# Altium schematic sheet 07_iMX 8X_LPDDR4.SchDoc
size A3; SheetNumber: 8; SheetTotal: 22
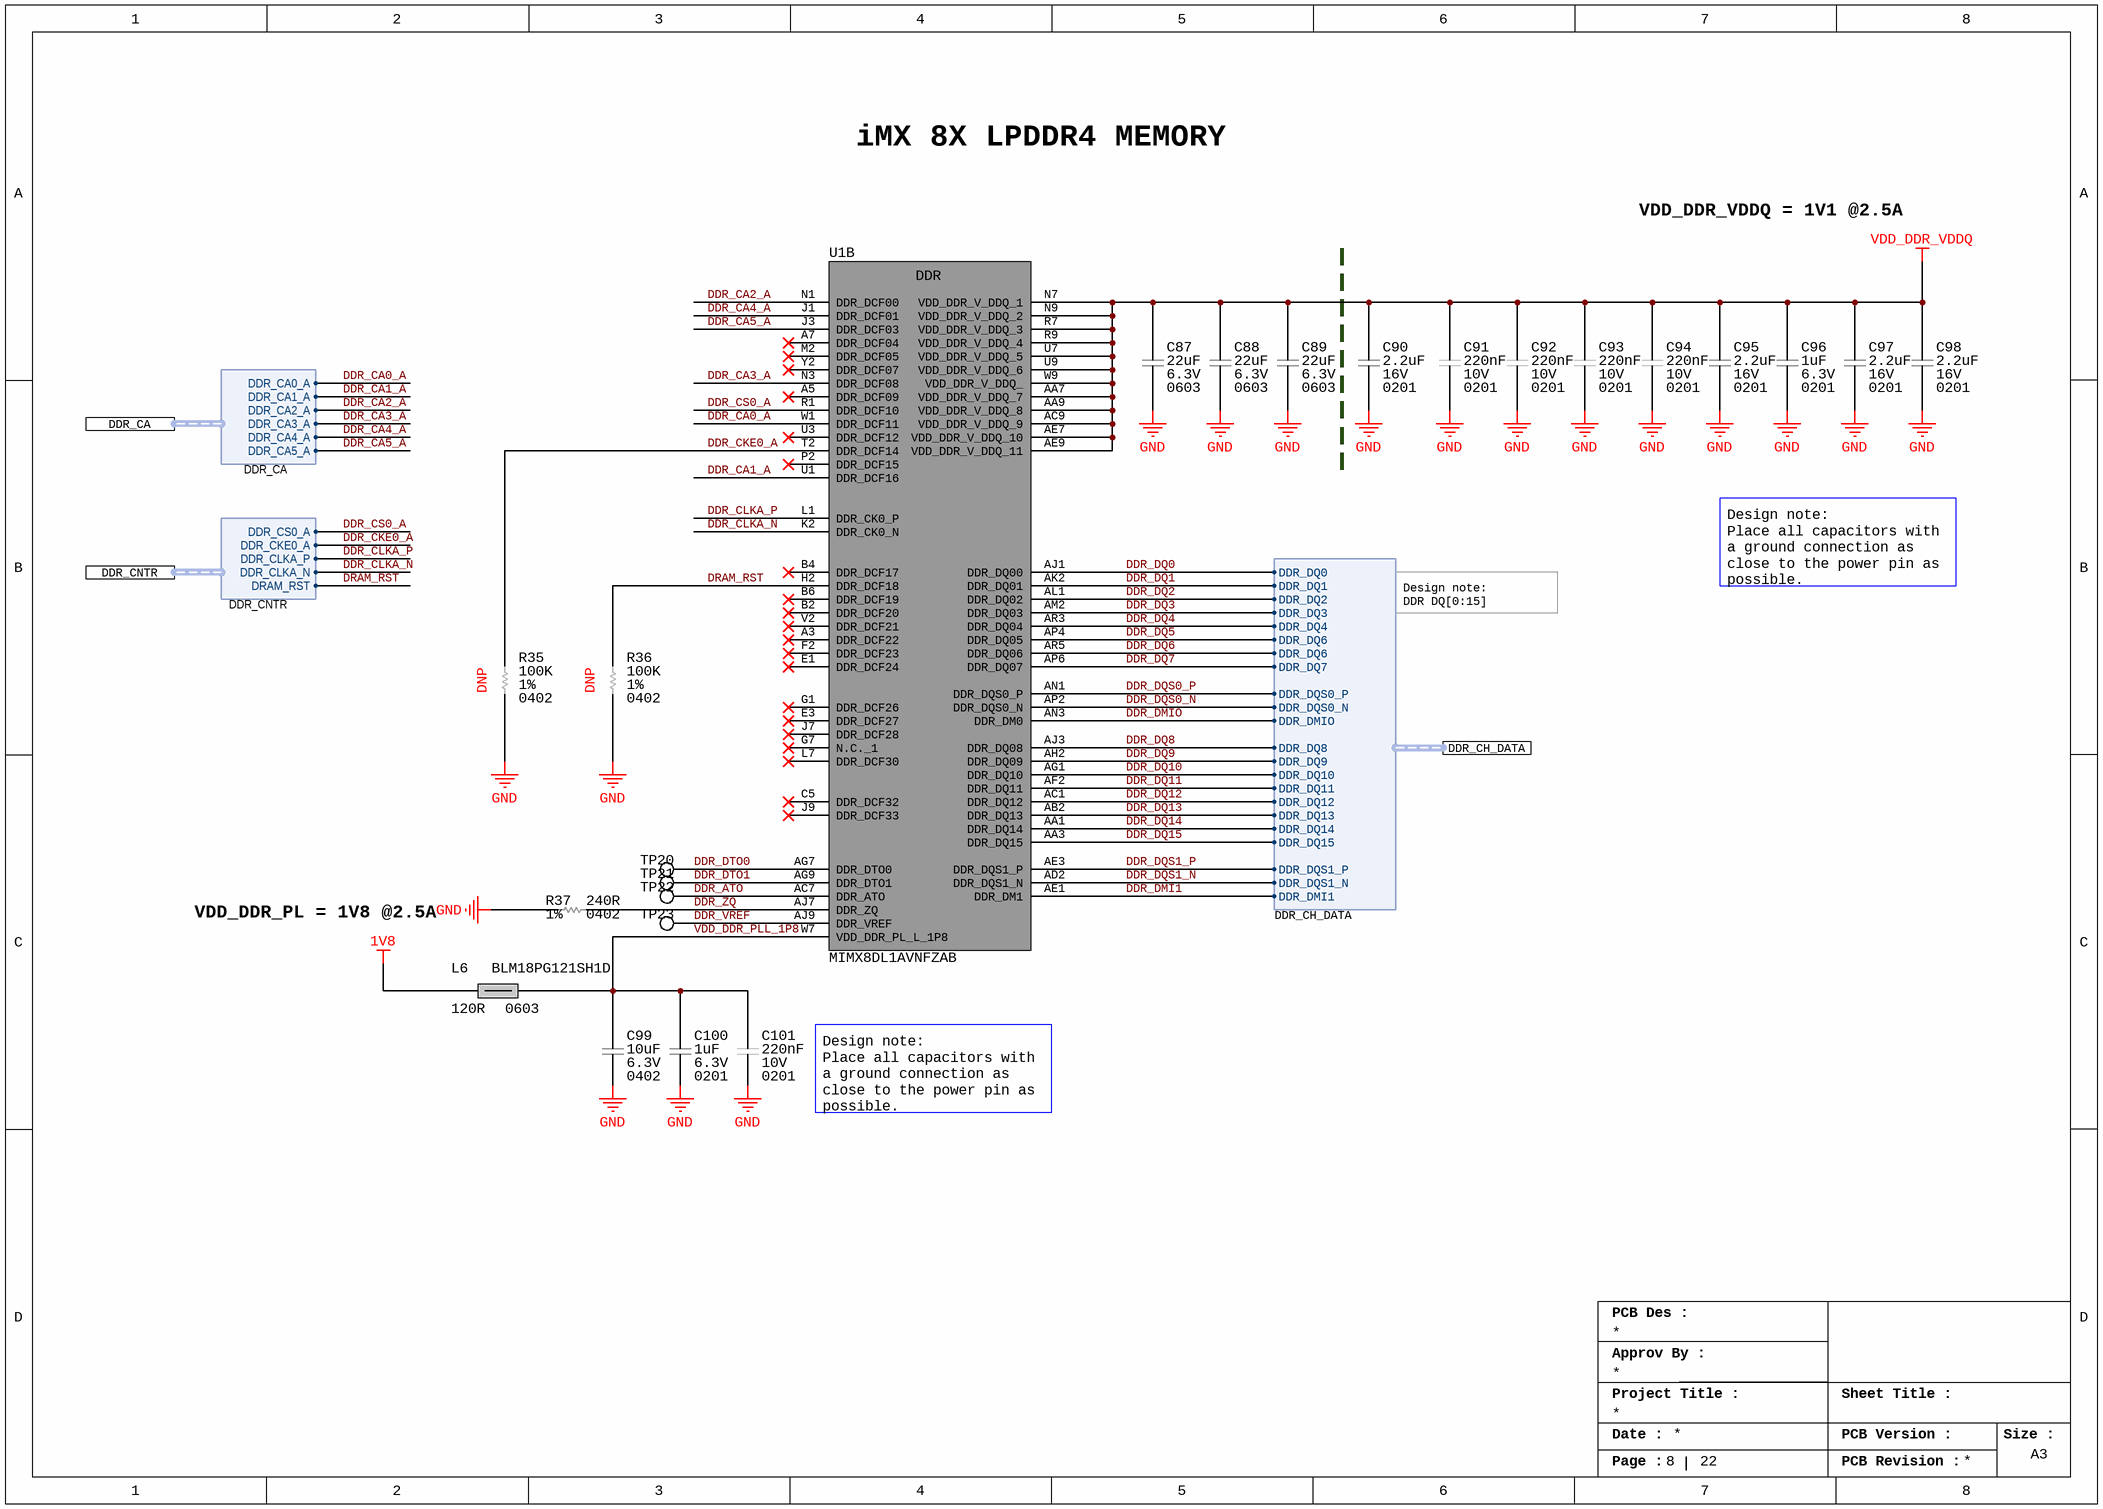
[diagram p0: 07_iMX 8X_LPDDR4.SchDoc]

## Parts
C87  Voltage Rating: 6.3V  Capacitance: 22uF  Case/Package: 0603  [CAP_0603_CAPC1608X08N]  (hidden comment: GRM188R60J226MEA0D)
C88  Voltage Rating: 6.3V  Capacitance: 22uF  Case/Package: 0603  [CAP_0603_CAPC1608X08N]  (hidden comment: GRM188R60J226MEA0D)
C89  Voltage Rating: 6.3V  Capacitance: 22uF  Case/Package: 0603  [CAP_0603_CAPC1608X08N]  (hidden comment: GRM188R60J226MEA0D)
C90  Capacitance: 2.2uF  Voltage Rating: 16V  Case/Package: 0201  [CAP_0201_CAPC0603X03N]  (hidden comment: GRM035R61C225ME01D)
C91  Voltage Rating (DC): 10V  Capacitance: 220nF  Case/Package: 0201  [CAP_0201_CAPC0603X03N]  (hidden comment: LMK063BJ224MP-F)
C92  Voltage Rating (DC): 10V  Capacitance: 220nF  Case/Package: 0201  [CAP_0201_CAPC0603X03N]  (hidden comment: LMK063BJ224MP-F)
C93  Voltage Rating (DC): 10V  Capacitance: 220nF  Case/Package: 0201  [CAP_0201_CAPC0603X03N]  (hidden comment: LMK063BJ224MP-F)
C94  Voltage Rating (DC): 10V  Capacitance: 220nF  Case/Package: 0201  [CAP_0201_CAPC0603X03N]  (hidden comment: LMK063BJ224MP-F)
C95  Capacitance: 2.2uF  Voltage Rating: 16V  Case/Package: 0201  [CAP_0201_CAPC0603X03N]  (hidden comment: GRM035R61C225ME01D)
C96  Voltage Rating (DC): 6.3V  Capacitance: 1uF  Case/Package: 0201  [CAP_0201_CAPC0603X03N]  (hidden comment: 02016D105MAT2A)
C97  Capacitance: 2.2uF  Voltage Rating: 16V  Case/Package: 0201  [CAP_0201_CAPC0603X03N]  (hidden comment: GRM035R61C225ME01D)
C98  Capacitance: 2.2uF  Voltage Rating: 16V  Case/Package: 0201  [CAP_0201_CAPC0603X03N]  (hidden comment: GRM035R61C225ME01D)
C99  Case/Package: 0402  Capacitance: 10uF  Voltage Rating: 6.3V  [CAP_0402_CAPC1005X05N]  (hidden comment: CL05A106MQ5NUNC)
C100  Voltage Rating (DC): 6.3V  Capacitance: 1uF  Case/Package: 0201  [CAP_0201_CAPC0603X03N]  (hidden comment: 02016D105MAT2A)
C101  Voltage Rating (DC): 10V  Capacitance: 220nF  Case/Package: 0201  [CAP_0201_CAPC0603X03N]  (hidden comment: LMK063BJ224MP-F)
L6  BLM18PG121SH1D  Impedance: 120R  Case/Package: 0603  [IND_0603_INDC1608X08N]
R35  Resistance: 100K  Tolerance: 1%  Case/Package: 0402  [RES_0402_RESC1005X04N]  (hidden comment: RC0402FR-07100KL)
R36  Resistance: 100K  Tolerance: 1%  Case/Package: 0402  [RES_0402_RESC1005X04N]  (hidden comment: RC0402FR-07100KL)
R37  Tolerance: 1%  Resistance: 240R  Case/Package: 0402  [RES_0402_RESC1005X04N]  (hidden comment: RC0402FR-07240RL)
TP20  NO COMPONENT  [TP_PAD_0.5MM_SMD_ROUND]  (value not drawn)  (no BOM)
TP21  NO COMPONENT  [TP_PAD_0.5MM_SMD_ROUND]  (value not drawn)  (no BOM)
TP22  NO COMPONENT  [TP_PAD_0.5MM_SMD_ROUND]  (value not drawn)  (no BOM)
TP23  NO COMPONENT  [TP_PAD_0.5MM_SMD_ROUND]  (value not drawn)  (no BOM)
U1  MIMX8DL1AVNFZAB  [MIMX8DL1AVNFZAB]  (part B of 15)

## Ports
DDR_CA (harness DDR_CA), DDR_CH_DATA (harness DDR_CH_DATA), DDR_CNTR (harness DDR_CNTR)

## Harnesses
DDR_CH_DATA: DDR_DQ0, DDR_DQ1, DDR_DQ2, DDR_DQ3, DDR_DQ4, DDR_DQ6, DDR_DQ6, DDR_DQ7, DDR_DQS0_P, DDR_DQS0_N, DDR_DMIO, DDR_DQ8, DDR_DQ9, DDR_DQ10, DDR_DQ11, DDR_DQ12, DDR_DQ13, DDR_DQ14, DDR_DQ15, DDR_DQS1_P, DDR_DQS1_N, DDR_DMI1
DDR_CA: DDR_CA0_A, DDR_CA1_A, DDR_CA2_A, DDR_CA3_A, DDR_CA4_A, DDR_CA5_A
DDR_CNTR: DDR_CS0_A, DDR_CKE0_A, DDR_CLKA_P, DDR_CLKA_N, DRAM_RST

## Nets
1V8: L6.1
GND: C87.1 C88.1 C89.1 C90.1 C91.1 C92.1 C93.1 C94.1 C95.1 C96.1 C97.1 C98.1 C99.1 C100.1 C101.1 R35.1 R36.1 R37.1
VDD_DDR_VDDQ: C87.2 C88.2 C89.2 C90.2 C91.2 C92.2 C93.2 C94.2 C95.2 C96.2 C97.2 C98.2 U1.AA7(VDD_DDR_V_DDQ_7) U1.AA9(VDD_DDR_V_DDQ_8) U1.AC9(VDD_DDR_V_DDQ_9) U1.AE7(VDD_DDR_V_DDQ_10) U1.AE9(VDD_DDR_V_DDQ_11) U1.N7(VDD_DDR_V_DDQ_1) U1.N9(VDD_DDR_V_DDQ_2) U1.R7(VDD_DDR_V_DDQ_3) U1.R9(VDD_DDR_V_DDQ_4) U1.U7(VDD_DDR_V_DDQ_5) U1.U9(VDD_DDR_V_DDQ_6) U1.W9(VDD_DDR_V_DDQ_)
DDR_ATO: TP22.1 U1.AC7(DDR_ATO)
DDR_CA0_A: U1.W1(DDR_DCF11) ; port DDR_CA.DDR_CA0_A
DDR_CA1_A: U1.U1(DDR_DCF16) ; port DDR_CA.DDR_CA1_A
DDR_CA2_A: U1.N1(DDR_DCF00) ; port DDR_CA.DDR_CA2_A
DDR_CA3_A: U1.N3(DDR_DCF08) ; port DDR_CA.DDR_CA3_A
DDR_CA4_A: U1.J1(DDR_DCF01) ; port DDR_CA.DDR_CA4_A
DDR_CA5_A: U1.J3(DDR_DCF03) ; port DDR_CA.DDR_CA5_A
DDR_CKE0_A: R35.2 U1.T2(DDR_DCF14) ; port DDR_CNTR.DDR_CKE0_A
DDR_CLKA_N: U1.K2(DDR_CK0_N) ; port DDR_CNTR.DDR_CLKA_N
DDR_CLKA_P: U1.L1(DDR_CK0_P) ; port DDR_CNTR.DDR_CLKA_P
DDR_CS0_A: U1.R1(DDR_DCF10) ; port DDR_CNTR.DDR_CS0_A
DDR_DMI1: U1.AE1(DDR_DM1) ; port DDR_CH_DATA.DDR_DMI1
DDR_DMIO: U1.AN3(DDR_DM0) ; port DDR_CH_DATA.DDR_DMIO
DDR_DQ0: U1.AJ1(DDR_DQ00) ; port DDR_CH_DATA.DDR_DQ0
DDR_DQ1: U1.AK2(DDR_DQ01) ; port DDR_CH_DATA.DDR_DQ1
DDR_DQ2: U1.AL1(DDR_DQ02) ; port DDR_CH_DATA.DDR_DQ2
DDR_DQ3: U1.AM2(DDR_DQ03) ; port DDR_CH_DATA.DDR_DQ3
DDR_DQ4: U1.AR3(DDR_DQ04) ; port DDR_CH_DATA.DDR_DQ4
DDR_DQ5: U1.AP4(DDR_DQ05) U1.AR5(DDR_DQ06) ; port DDR_CH_DATA.DDR_DQ6  [also labelled DDR_DQ6]
DDR_DQ7: U1.AP6(DDR_DQ07) ; port DDR_CH_DATA.DDR_DQ7
DDR_DQ8: U1.AJ3(DDR_DQ08) ; port DDR_CH_DATA.DDR_DQ8
DDR_DQ9: U1.AH2(DDR_DQ09) ; port DDR_CH_DATA.DDR_DQ9
DDR_DQ10: U1.AG1(DDR_DQ10) ; port DDR_CH_DATA.DDR_DQ10
DDR_DQ11: U1.AF2(DDR_DQ11) ; port DDR_CH_DATA.DDR_DQ11
DDR_DQ12: U1.AC1(DDR_DQ12) ; port DDR_CH_DATA.DDR_DQ12
DDR_DQ13: U1.AB2(DDR_DQ13) ; port DDR_CH_DATA.DDR_DQ13
DDR_DQ14: U1.AA1(DDR_DQ14) ; port DDR_CH_DATA.DDR_DQ14
DDR_DQ15: U1.AA3(DDR_DQ15) ; port DDR_CH_DATA.DDR_DQ15
DDR_DQS0_N: U1.AP2(DDR_DQS0_N) ; port DDR_CH_DATA.DDR_DQS0_N
DDR_DQS0_P: U1.AN1(DDR_DQS0_P) ; port DDR_CH_DATA.DDR_DQS0_P
DDR_DQS1_N: U1.AD2(DDR_DQS1_N) ; port DDR_CH_DATA.DDR_DQS1_N
DDR_DQS1_P: U1.AE3(DDR_DQS1_P) ; port DDR_CH_DATA.DDR_DQS1_P
DDR_DTO0: TP20.1 U1.AG7(DDR_DTO0)
DDR_DTO1: TP21.1 U1.AG9(DDR_DTO1)
DDR_VREF: TP23.1 U1.AJ9(DDR_VREF)
DDR_ZQ: R37.2 U1.AJ7(DDR_ZQ)
DRAM_RST: R36.2 U1.H2(DDR_DCF18) ; port DDR_CNTR.DRAM_RST
VDD_DDR_PLL_1P8: C99.2 C100.2 C101.2 L6.2 U1.W7(VDD_DDR_PL_L_1P8)

Not connected (* = marked no-connect by the designer): U1 A3(DDR_DCF22)* A5(DDR_DCF09)* A7(DDR_DCF04)* B2(DDR_DCF20)* B4(DDR_DCF17)* B6(DDR_DCF19)* C5(DDR_DCF32)* E1(DDR_DCF24)* E3(DDR_DCF27)* F2(DDR_DCF23)* G1(DDR_DCF26)* G7(N.C._1)* J7(DDR_DCF28)* J9(DDR_DCF33)* L7(DDR_DCF30)* M2(DDR_DCF05)* P2(DDR_DCF15)* U3(DDR_DCF12)* V2(DDR_DCF21)* Y2(DDR_DCF07)*

## Notes on the sheet
- iMX 8X LPDDR4 MEMORY
- VDD_DDR_VDDQ = 1V1 @2.5A
- Design note:
  Place all capacitors with a ground connection as close to the power pin as possible.
- Design note:
  DDR DQ[0:15]
- (near R35) DNP
- (near R36) DNP
- VDD_DDR_PL = 1V8 @2.5A
- PCB Des :
- Approv By :
- Project Title :
- Sheet Title :
- Date :
- PCB Version :
- Size :
- A3
- Page :
- PCB Revision :
- (in symbol IC_MPU_ARM_1.2GHz_MIMX8DL1AVNFZAB, part B) DDR

## Library data of the parts
C87-C89 = CAP_22uF_6.3V_X5R_0603: Multilayer Ceramic Capacitor, 22 uF, 6.3 V, ï¿½ 20%, X5R, 0603 [1608 Metric]; Manufacturer: Murata; Supplier 1: Digikey; Manufacturer Part Number: GRM188R60J226MEA0D; RoHS: Yes; Category: Ceramic Capacitors; Stock 1: 4736669; Pricing 1: 1=0.2, 10=0.113, 50=0.0794, 100=0.069, 500=0.05144, 1000=0.04599 (USD); Mount: Surface Mount; Number of Pins: 2; Case Code (Metric): 1608; Case Code (Imperial): 0603; Weight: 0.000222oz; Material: Ceramic; Min Operating Temperature: -55°C; Max Operating Temperature: 85°C; Packaging: Tape and Reel; Package Quantity: 1; Series: GRM; Tolerance: 20%; Dielectric: X5R; Termination: SMD/SMT; Voltage Rating (DC): 6.3V; Length: 0.063inch; Width: 0.031inch; Height: 0.8mm; Thickness: 0.039inch; Lead Free: Lead Free; RoHS Compliant: Yes; Reach SVHC Compliant: No; ComponentLink1URL: https://datasheet.ciiva.com/29540/partnumbering-e-01-29540441.pdf?src-supplier=Digikey; ComponentLink1Description: https://datasheet.ciiva.com/29540/partnumbering-e-01-29540441.pdf?src-supplier=Digikey; ComponentLink2URL: https://datasheet.ciiva.com/29540/partnumbering-e-01-29540442.pdf?src-supplier=Digikey; ComponentLink2Description: https://datasheet.ciiva.com/29540/partnumbering-e-01-29540442.pdf?src-supplier=Digikey; ComponentLink3URL: https://datasheet.ciiva.com/29540/partnumbering-e-01-29540443.pdf?src-supplier=Digikey; ComponentLink3Description: https://datasheet.ciiva.com/29540/partnumbering-e-01-29540443.pdf?src-supplier=Digikey; Supplier Part Number 1: 490-7611-1-ND
C90 C95 C97 C98 = CAP_2.2uF_16V_X5R_0201: General Up to 85C Reflow soldering; Manufacturer: Murata; Material: Ceramic; Dielectric: X5R; Tolerance: 20%; Supplier 1: Digikey; Manufacturer Part Number: GRM035R61C225ME01D; RoHS: No; Category: Ceramic Capacitors; Stock 1: 18674; Pricing 1: 1=0.36, 10=0.233, 50=0.1636, 100=0.1321, 500=0.09814, 1000=0.08587, 2500=0.08178, 5000=0.07565 (USD); Min Operating Temperature: -55°C; Max Operating Temperature: 85°C; Voltage Rating (DC): 16V; Length: 600um; Width: 300um; Height: 550um; Thickness: 500um; RoHS Compliant: Yes; ComponentLink1URL: https://datasheet.octopart.com/GRM035R61C225ME01D-Murata-datasheet-165579666.pdf?src-supplier=TME; ComponentLink1Description: https://datasheet.octopart.com/GRM035R61C225ME01D-Murata-datasheet-165579666.pdf?src-supplier=TME; Supplier Part Number 1: 490-GRM035R61C225ME01DCT-ND
C91-C94 C101 = CAP_0.22UF_10V_X5R_0201: Multilayer Ceramic Capacitors (High dielectric type), 10V, 0.22 uF, ± 20 %, 0201, X5R, RoHS; Manufacturer: Taiyo Yuden; Material: 4241ConductorMaterial; Tolerance: 20%; Supplier 1: Digikey; Manufacturer Part Number: LMK063BJ224MP-F; RoHS: Yes; Category: Ceramic Capacitors; Stock 1: 6053224; Pricing 1: 1=0.12, 10=0.08, 50=0.0478, 100=0.0375, 500=0.02772, 1000=0.02295, 2500=0.02136, 5000=0.01954 (USD); Mount: Surface Mount; Case Code (Metric): 0603; Case Code (Imperial): 0201; Min Operating Temperature: -55°C; Max Operating Temperature: 85°C; Voltage Rating: 10V; Packaging: Tape and Reel; Package Quantity: 15000; Dielectric: X5R; Termination: SMD/SMT; Voltage: 10V; Series: M; Construction: Flat; Length: 0.6mm; Width: 0.3mm; Height: 0.3mm; Depth: 0.3mm; Radiation Hardening: No; Halogen Free: Halogen Free; RoHS Compliant: Yes; Reach SVHC Compliant: Unknown; ComponentLink1URL: https://datasheet.ciiva.com/134/lmk063bj224mp-f-ss-134995.pdf?src-supplier=Digikey; ComponentLink1Description: https://datasheet.ciiva.com/134/lmk063bj224mp-f-ss-134995.pdf?src-supplier=Digikey; ComponentLink2URL: https://datasheet.ciiva.com/11464/lmk063bj224mp-f-ss-11464053.pdf?src-supplier=Avnet; ComponentLink2Description: https://datasheet.ciiva.com/11464/lmk063bj224mp-f-ss-11464053.pdf?src-supplier=Avnet; ComponentLink3URL: https://datasheet.ciiva.com/15921/1589lmk063bj224mp-f-15921250.pdf?src-supplier=Onlinecomponents.com; ComponentLink3Description: https://datasheet.ciiva.com/15921/1589lmk063bj224mp-f-15921250.pdf?src-supplier=Onlinecomponents.com; ComponentLink4URL: https://datasheet.ciiva.com/26872/getdatasheetpartid-639019-26872592.pdf?src-supplier=Verical; ComponentLink4Description: https://datasheet.ciiva.com/26872/getdatasheetpartid-639019-26872592.pdf?src-supplier=Verical; ComponentLink5URL: https://datasheet.ciiva.com/30243/100lmk063bj224mp-f-30243150.pdf?src-supplier=Onlinecomponents.com; ComponentLink5Description: https://datasheet.ciiva.com/30243/100lmk063bj224mp-f-30243150.pdf?src-supplier=Onlinecomponents.com; ComponentLink6URL: https://datasheet.ciiva.com/28645/746258-28645141.pdf?src-supplier=Element14; ComponentLink6Description: https://datasheet.ciiva.com/28645/746258-28645141.pdf?src-supplier=Element14; ComponentLink7URL: https://datasheet.ciiva.com/5422/mlcc-all-e-541559-5422365.pdf?src-supplier=Mouser; ComponentLink7Description: https://datasheet.ciiva.com/5422/mlcc-all-e-541559-5422365.pdf?src-supplier=Mouser; Supplier Part Number 1: 587-2483-1-ND
C96 C100 = CAP_1UF_6.3V_X5R_0201: 0201 1 uF 6.3 V ±20 % Tolerance X5R Surface Mount Multilayer Ceramic Capacitor; Manufacturer: Kyocera AVX; Tolerance: 20%; Supplier 1: Mouser; Manufacturer Part Number: 02016D105MAT2A; RoHS: Yes; Category: Ceramic Capacitors; Stock 1: 1026413; Pricing 1: 1=0.1, 10=0.028, 50=0.028, 100=0.014, 1000=0.008, 10000=0.006 (USD); Mount: Surface Mount; Number of Pins: 2; Case Code (Metric): 0603; Case Code (Imperial): 0201; Min Operating Temperature: -55°C; Max Operating Temperature: 85°C; Packaging: Cut Tape; Series: -; Voltage Rating: 6.3V; Package Quantity: 1; Length: 0.024inch; Width: 0.012inch; Thickness: 0.013inch; Depth: 0.3mm; Lead Free: Lead Free; RoHS Compliant: Yes; Reach SVHC Compliant: No; ComponentLink1URL: https://datasheet.ciiva.com/6265/cx5r-6265595.pdf?src-supplier=Digi-Key; ComponentLink1Description: https://datasheet.ciiva.com/6265/cx5r-6265595.pdf?src-supplier=Digi-Key; ComponentLink2URL: https://datasheet.ciiva.com/1123/1666675-1123122.pdf?src-supplier=Element14; ComponentLink2Description: https://datasheet.ciiva.com/1123/1666675-1123122.pdf?src-supplier=Element14; ComponentLink3URL: https://datasheet.ciiva.com/14891/cx5r-14891029.pdf?src-supplier=Digi-Key; ComponentLink3Description: https://datasheet.ciiva.com/14891/cx5r-14891029.pdf?src-supplier=Digi-Key; ComponentLink4URL: https://datasheet.ciiva.com/7614/cx5r-7614682.pdf?src-supplier=Digi-Key; ComponentLink4Description: https://datasheet.ciiva.com/7614/cx5r-7614682.pdf?src-supplier=Digi-Key; ComponentLink5URL: https://datasheet.ciiva.com/14891/cx5r-14891030.pdf?src-supplier=Digi-Key; ComponentLink5Description: https://datasheet.ciiva.com/14891/cx5r-14891030.pdf?src-supplier=Digi-Key; Supplier Part Number 1: 581-02016D105MAT2A; Dielectric: X5R
C99 = CAP_10UF_6.3V_X5R_0402: Cap Ceramic 10uF 6.3V X5R 20% SMD 0402 85C T/R; Manufacturer: Samsung; Supplier 1: Digikey; Manufacturer Part Number: CL05A106MQ5NUNC; RoHS: Yes; Category: Ceramic Capacitors; Stock 1: 6097180; Pricing 1: 1=0.24, 10=0.153, 50=0.0968, 100=0.0774, 500=0.05588, 1000=0.04943, 2500=0.04728, 5000=0.04299 (USD); Mount: Surface Mount; Case Code (Metric): 1005; Case Code (Imperial): 0402; Min Operating Temperature: -55°C; Max Operating Temperature: 85°C; Packaging: Tape and Reel; Tolerance: 20%; Dielectric: X5R; Series: CL; Package Quantity: 1; Construction: Flat; Length: 1mm; Width: 0.02inch; Height: 0.5mm; Depth: 0.5mm; Thickness: 0.028inch; Radiation Hardening: No; RoHS Compliant: Yes; ComponentLink1URL: https://datasheet.ciiva.com/16437/cl05a106mq5nunc-16437356.pdf?src-supplier=Future+Electronics; ComponentLink1Description: https://datasheet.ciiva.com/16437/cl05a106mq5nunc-16437356.pdf?src-supplier=Future+Electronics; ComponentLink2URL: https://datasheet.ciiva.com/26877/getdatasheetpartid-355289-26877841.pdf?src-supplier=Verical; ComponentLink2Description: https://datasheet.ciiva.com/26877/getdatasheetpartid-355289-26877841.pdf?src-supplier=Verical; Supplier Part Number 1: 1276-1451-1-ND
L6 = IND_FERRITE_BEADS_120R_2A_0603_BLM18PG121SH1D: Ferrite Beads Multi-Layer 120Ohm 25% 100MHz 2A 50mOhm DCR 0603 Automotive Paper T/R; Manufacturer: Murata; Number of Lines: 1; Shielding: Unshielded; DC Resistance-Max: 50mR; Supplier 1: Digi-Key; Manufacturer Part Number: BLM18PG121SH1D; RoHS: Yes; Category: Ferrite Beads and Chips; Stock 1: 282143; Pricing 1: 1=0.11, 10=0.086, 25=0.0772, 50=0.0566, 100=0.0489, 250=0.03864, 500=0.03262, 1000=0.02747 (USD); Mount: Surface Mount; Case Code (Metric): 1608; Case Code (Imperial): 0603; Weight: 7.1E-05oz; Contact Plating: Tin,Matte; Material: Ferrite; Min Operating Temperature: -55°C; Max Operating Temperature: 125°C; Tolerance: 25%; Packaging: Tape and Reel; Package Quantity: 1; Current Rating: 2A; Max Current Rating: 2A; Termination: SMD/SMT; Max DC Current: 2A; Test Frequency: 100MHz; Number of Circuits: 1; Series: EMIFIL®, BLM18P; Length: 1.6mm; Width: 0.031inch; Height: 0.8mm; Depth: 0.8mm; Ratings: AEC-Q200; Lead Free: Lead Free; RoHS Compliant: Yes; ComponentLink1URL: https://datasheet.octopart.com/BLM18PG121SH1D-Murata-datasheet-141273661.pdf?src-supplier=Element14; ComponentLink1Description: https://datasheet.octopart.com/BLM18PG121SH1D-Murata-datasheet-141273661.pdf?src-supplier=Element14; ComponentLink2URL: https://datasheet.octopart.com/BLM18PG121SH1D-Murata-datasheet-62086335.pdf?src-supplier=Future+Electronics; ComponentLink2Description: https://datasheet.octopart.com/BLM18PG121SH1D-Murata-datasheet-62086335.pdf?src-supplier=Future+Electronics; ComponentLink3URL: http://search.murata.co.jp/Ceramy/image/img/PDF/ENG/L0132S0193BLM18P.pdf?src-supplier=Avnet; ComponentLink3Description: http://search.murata.co.jp/Ceramy/image/img/PDF/ENG/L0132S0193BLM18P.pdf?src-supplier=Avnet; ComponentLink4URL: https://www.murata.com/en-us/products/productdata/8796738650142/ENFA0003.pdf?src-supplier=Digi-Key; ComponentLink4Description: https://www.murata.com/en-us/products/productdata/8796738650142/ENFA0003.pdf?src-supplier=Digi-Key; Supplier Part Number 1: 490-7815-6-ND
R35 R36 = RES_100K_1%_100mW_0402: SMD Chip Resistor, 100 kOhm, ± 1%, 63 mW, 0402 [1005 Metric], Thick Film, General Purpose; Manufacturer: Yageo; Temperature Coefficient: 100ppm/°C; Power Rating: 63mW; Voltage Rating: 50V; Supplier 1: Digi-Key; Manufacturer Part Number: RC0402FR-07100KL; RoHS: Yes; Category: Chip SMD Resistors; Stock 1: 27579413; Pricing 1: 1=0.1, 10=0.014, 50=0.0084, 100=0.007, 500=0.00464, 1000=0.00396, 5000=0.00282 (USD); Case Code (Metric): 1005; Case Code (Imperial): 0402; Min Operating Temperature: -55°C; Max Operating Temperature: 155°C; Resistor Type: Thick Film; Packaging: Tape and Reel; Package Quantity: 1; Number of Terminations: 2; Termination: SMD/SMT; Max Power Dissipation: 63mW; Features: Moisture Resistant; Series: RC; Resistance Tolerance: 1%; Construction: Rectangular; Technology: THICK FILM; Voltage Rating (AC): 50V; Length: 0.039inch; Width: 0.02inch; Height: 0.016inch; Depth: 0.5mm; Reach SVHC Compliant: No; RoHS Compliant: Yes; Lead Free: 5697LeadFree; Military Standard: Not; ComponentLink1URL: https://datasheet.ciiva.com/11819/0900766b80c66297-11819452.pdf?src-supplier=Rs; ComponentLink1Description: https://datasheet.ciiva.com/11819/0900766b80c66297-11819452.pdf?src-supplier=Rs; ComponentLink2URL: https://datasheet.ciiva.com/22747/1018594-22747509.pdf?src-supplier=Element14; ComponentLink2Description: https://datasheet.ciiva.com/22747/1018594-22747509.pdf?src-supplier=Element14; ComponentLink3URL: https://datasheet.ciiva.com/2453/pyu-r-int-thick-7-2453362.pdf?src-supplier=Digi-Key; ComponentLink3Description: https://datasheet.ciiva.com/2453/pyu-r-int-thick-7-2453362.pdf?src-supplier=Digi-Key; ComponentLink4URL: https://datasheet.ciiva.com/12667/pyu-rc0402-51-rohs-l-6-r-12667930.pdf?src-supplier=Mouser; ComponentLink4Description: https://datasheet.ciiva.com/12667/pyu-rc0402-51-rohs-l-6-r-12667930.pdf?src-supplier=Mouser; ComponentLink5URL: https://datasheet.ciiva.com/15189/getdatasheetpartid-323696-15189334.pdf?src-supplier=Verical; ComponentLink5Description: https://datasheet.ciiva.com/15189/getdatasheetpartid-323696-15189334.pdf?src-supplier=Verical; ComponentLink6URL: https://datasheet.ciiva.com/2453/pyu-r-int-thick-7-2453363.pdf?src-supplier=Digi-Key; ComponentLink6Description: https://datasheet.ciiva.com/2453/pyu-r-int-thick-7-2453363.pdf?src-supplier=Digi-Key; ComponentLink7URL: https://datasheet.ciiva.com/2453/pyu-r-int-thick-7-2453361.pdf?src-supplier=Digi-Key; ComponentLink7Description: https://datasheet.ciiva.com/2453/pyu-r-int-thick-7-2453361.pdf?src-supplier=Digi-Key; Supplier Part Number 1: 311-100KLRCT-ND
R37 = RES_240R_1%_63mW_0402: SMD Chip Resistor, 240 Ohm, ± 1%, 63 mW, 0402 [1005 Metric], Thick Film, General Purpose; Manufacturer: Yageo; Power Rating: 63mW; Voltage Rating: 50V; Temperature Coefficient: 100ppm/°C; Supplier 1: Digi-Key; Manufacturer Part Number: RC0402FR-07240RL; RoHS: Yes; Category: Chip SMD Resistors; Stock 1: 1880273; Pricing 1: 1=0.1, 10=0.014, 50=0.0084, 100=0.007, 500=0.00464, 1000=0.00396, 5000=0.00282 (USD); Case Code (Metric): 1005; Case Code (Imperial): 0402; Size Code: 0402; Min Operating Temperature: -55°C; Max Operating Temperature: 155°C; Resistor Type: Thick Film; Packaging: Tape and Reel; Number of Terminations: 2; Termination: SMD/SMT; Max Power Dissipation: 63mW; Voltage Rating (DC): 50V; Features: Moisture Resistant; Series: RC; Construction: Rectangular; Resistance Tolerance: 1%; Length: 1mm; Depth: 0.5mm; RoHS Compliant: Yes; Military Standard: Not; Lead Free: Lead Free; Reach SVHC Compliant: Unknown; ComponentLink1URL: https://datasheet.ciiva.com/7849/1018594-7849915.pdf?src-supplier=Element14; ComponentLink1Description: https://datasheet.ciiva.com/7849/1018594-7849915.pdf?src-supplier=Element14; ComponentLink2URL: https://datasheet.ciiva.com/7849/1018594-7849916.pdf?src-supplier=Element14; ComponentLink2Description: https://datasheet.ciiva.com/7849/1018594-7849916.pdf?src-supplier=Element14; ComponentLink3URL: https://datasheet.ciiva.com/2519/pyu-r-int-thick-7-2519158.pdf?src-supplier=Digi-Key; ComponentLink3Description: https://datasheet.ciiva.com/2519/pyu-r-int-thick-7-2519158.pdf?src-supplier=Digi-Key; ComponentLink4URL: https://datasheet.ciiva.com/2519/pyu-r-int-thick-7-2519157.pdf?src-supplier=Digi-Key; ComponentLink4Description: https://datasheet.ciiva.com/2519/pyu-r-int-thick-7-2519157.pdf?src-supplier=Digi-Key; ComponentLink5URL: https://datasheet.ciiva.com/2519/pyu-r-int-thick-7-2519156.pdf?src-supplier=Digi-Key; ComponentLink5Description: https://datasheet.ciiva.com/2519/pyu-r-int-thick-7-2519156.pdf?src-supplier=Digi-Key; ComponentLink6URL: https://datasheet.ciiva.com/12669/pyu-rc0402-51-rohs-l-6-r-12669689.pdf?src-supplier=Mouser; ComponentLink6Description: https://datasheet.ciiva.com/12669/pyu-rc0402-51-rohs-l-6-r-12669689.pdf?src-supplier=Mouser; ComponentLink7URL: https://datasheet.ciiva.com/17419/pyu-rc0402-51-rohs-l-6-r-17419482.pdf?src-supplier=Future+Electronics; ComponentLink7Description: https://datasheet.ciiva.com/17419/pyu-rc0402-51-rohs-l-6-r-17419482.pdf?src-supplier=Future+Electronics; Supplier Part Number 1: 311-240LRCT-ND
TP20-TP23 = TP_PAD_SMD_SMALL: Test Point, SMD pad, round, 1.5mm, 1.6mm, 3mm diameter
U1 = IC_MPU_ARM_1.2GHz_MIMX8DL1AVNFZAB: I.MX8 Dxl 15SQ / Tray Rohs Compliant: Yes; Manufacturer: NXP Semiconductors; Supplier 1: Mouser; Manufacturer Part Number: MIMX8DL1AVNFZAB; RoHS: No; Category: Uncategorized; Stock 1: 196; Pricing 1: 1=46.19, 10=40.26, 25=38.57, 50=38.56, 100=33.3, 252=33.16, 1000=33.3, 10000=33.3 (USD); Supplier Part Number 1: 771-MIMX8DL1AVNFZAB